# EAGLE design breakout (EAGLE 7.4.0)
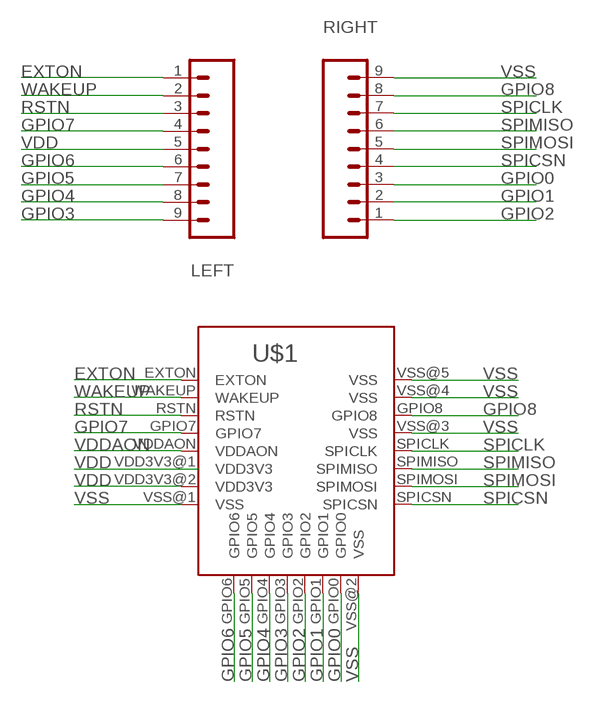
[diagram p0: schematic, sheet 1]

## Parts
LEFT  M09  [1X09]
RIGHT  M09  [1X09]
U$1  DWM1000  [DWM1000]

## Nets
EXTON: LEFT.1 U$1.EXTON
GPIO0: RIGHT.3 U$1.GPIO0
GPIO1: RIGHT.2 U$1.GPIO1
GPIO2: RIGHT.1 U$1.GPIO2
GPIO3: LEFT.9 U$1.GPIO3
GPIO4: LEFT.8 U$1.GPIO4
GPIO5: LEFT.7 U$1.GPIO5
GPIO6: LEFT.6 U$1.GPIO6
GPIO7: LEFT.4 U$1.GPIO7
GPIO8: RIGHT.8 U$1.GPIO8
RSTN: LEFT.3 U$1.RSTN
SPICLK: RIGHT.7 U$1.SPICLK
SPICSN: RIGHT.4 U$1.SPICSN
SPIMISO: RIGHT.6 U$1.SPIMISO
SPIMOSI: RIGHT.5 U$1.SPIMOSI
VDD: LEFT.5 U$1.VDD3V3@2(VDD3V3)
VDDAON: U$1.VDDAON
VSS: RIGHT.9 U$1.VSS@1(VSS) U$1.VSS@2(VSS) U$1.VSS@3(VSS) U$1.VSS@4(VSS) U$1.VSS@5(VSS)
WAKEUP: LEFT.2 U$1.WAKEUP

## Power pins joined to a net without a drawn wire
VDD3V3: U$1.VDD3V3@1(VDD3V3)

## Library data of the parts
LEFT RIGHT = SparkFun-Connectors:M09: Header 9 Standard 9-pin 0.1" header. Use with straight break away headers (SKU : PRT-00116), right angle break away headers (PRT-00553), swiss pins (PRT-00743), machine pins (PRT-00117), and female headers (PRT-00115).
U$1 = myParts:DWM1000

## Board
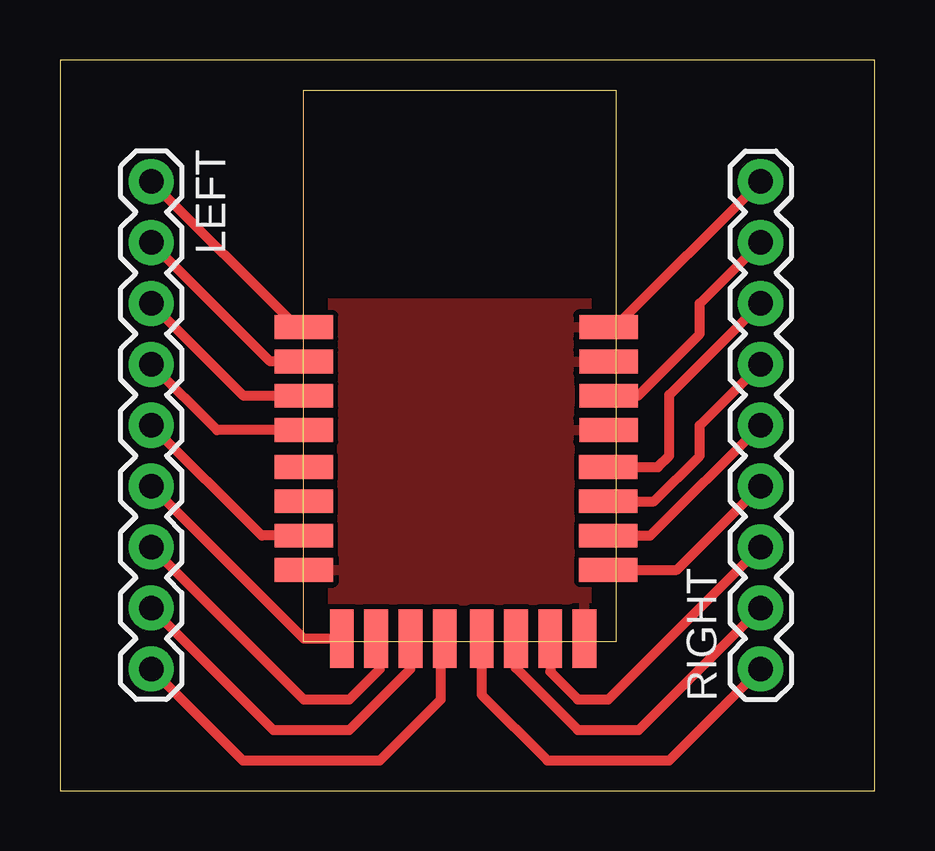
[diagram p1: board, top side]

Size 33.96 x 30.47 mm. Coordinates in mm from the lower left corner, seen from the top.
Outline: 0,0 33.96,0 33.96,30.47 0,30.47 0,0
Copper layers (1*16): Top 0.035mm / dielectric 1.5mm / Bottom 0.035mm
Design rules "default": minimum track width 10mil, minimum drill 24mil, track to track 8mil, track to pad 8mil, pad to pad 8mil, via to via 8mil, smd to smd 8mil, copper to edge 40mil, drill to drill 8mil, minimum pad ring 10mil, minimum via ring 8mil, stop-mask expansion 4mil, vias tented up to drill 0mil, thermal gap 10mil

### Footprints (pad centres in the part's own frame; a part is rotated, then mirrored left to right if it is on the bottom)
1X09 = drill 1.016 pad 1.88: 1 0,0; 2 2.54,0; 3 5.08,0; 4 7.62,0; 5 10.16,0; 6 12.7,0; 7 15.24,0; 8 17.78,0; 9 20.32,0
DWM1000 = smd 2.438 x 0.991: EXTON -5.07,4.09; GPIO7 -5.07,-0.2; GPIO8 7.63,1.23; RSTN -5.07,1.23; SPICLK 7.62,-1.74; SPICSN 7.62,-6.03; SPIMISO 7.62,-3.17; SPIMOSI 7.62,-4.6; VDD3V3@1 -5.08,-3.17; VDD3V3@2 -5.08,-4.6; VDDAON -5.08,-1.74; VSS@1 -5.08,-6.03; VSS@3 7.63,-0.2; VSS@4 7.63,2.66; VSS@5 7.63,4.09; WAKEUP -5.07,2.66 | smd 0.991 x 2.438: GPIO0 5.2,-8.9; GPIO1 3.77,-8.9; GPIO2 2.34,-8.9; GPIO3 0.8,-8.89; GPIO4 -0.63,-8.89; GPIO5 -2.06,-8.89; GPIO6 -3.49,-8.89; VSS@2 6.63,-8.9

### Placement (x,y rotation side)
LEFT  3.81,25.4 270 top
RIGHT  29.21,5.08 90 top
U$1  15.24,15.24 0 top

### Tracks (layer width: path | path; a pad name or v marks a point on that pad's centre or on a via)
EXTON
  Top 0.406: U$1.EXTON 9.88,19.33 LEFT.1
GPIO0
  Top 0.406: U$1.GPIO0 20.44,4.96 21.59,3.81 22.86,3.81 RIGHT.3
GPIO1
  Top 0.406: U$1.GPIO1 19.01,5.12 21.59,2.54 24.13,2.54 RIGHT.2
GPIO2
  Top 0.406: U$1.GPIO2 17.58,4.01 20.32,1.27 25.4,1.27 RIGHT.1
GPIO3
  Top 0.406: LEFT.9 7.62,1.27 13.34,1.27 15.88,3.81 15.88,6.18 U$1.GPIO3
GPIO4
  Top 0.406: LEFT.8 8.89,2.54 12.06,2.54 14.61,5.08 U$1.GPIO4
GPIO5
  Top 0.406: LEFT.7 10.16,3.81 12.06,3.81 13.34,5.08 13.34,6.2 U$1.GPIO5
GPIO6
  Top 0.406: LEFT.6 10.16,6.35 U$1.GPIO6
GPIO7
  Top 0.406: U$1.GPIO7 6.55,15.04 LEFT.4
GPIO8
  Top 0.406: U$1.GPIO8 24.09,16.47 26.67,19.05 26.67,20.32 RIGHT.8
RSTN
  Top 0.406: U$1.RSTN 7.66,16.47 LEFT.3
SPICLK
  Top 0.406: U$1.SPICLK 24.93,13.5 25.4,13.97 25.4,16.51 RIGHT.7
SPICSN
  Top 0.406: U$1.SPICSN 25.72,9.21 RIGHT.4
SPIMISO
  Top 0.406: U$1.SPIMISO 24.77,12.07 26.67,13.97 26.67,15.24 RIGHT.6
SPIMOSI
  Top 0.406: U$1.SPIMOSI 24.61,10.64 RIGHT.5
VDD
  Top 0.406: U$1.VDD3V3@2 8.41,10.64 LEFT.5
VSS
  Top 0.406: U$1.VSS@5 23.14,19.33 RIGHT.9
  pour Top: 10.16,20.32 10.16,6.35 22.86,6.35 22.86,20.32
WAKEUP
  Top 0.406: U$1.WAKEUP 8.77,17.9 LEFT.2